# EAGLE design TheSmartTenDollarJob (EAGLE 6.4)
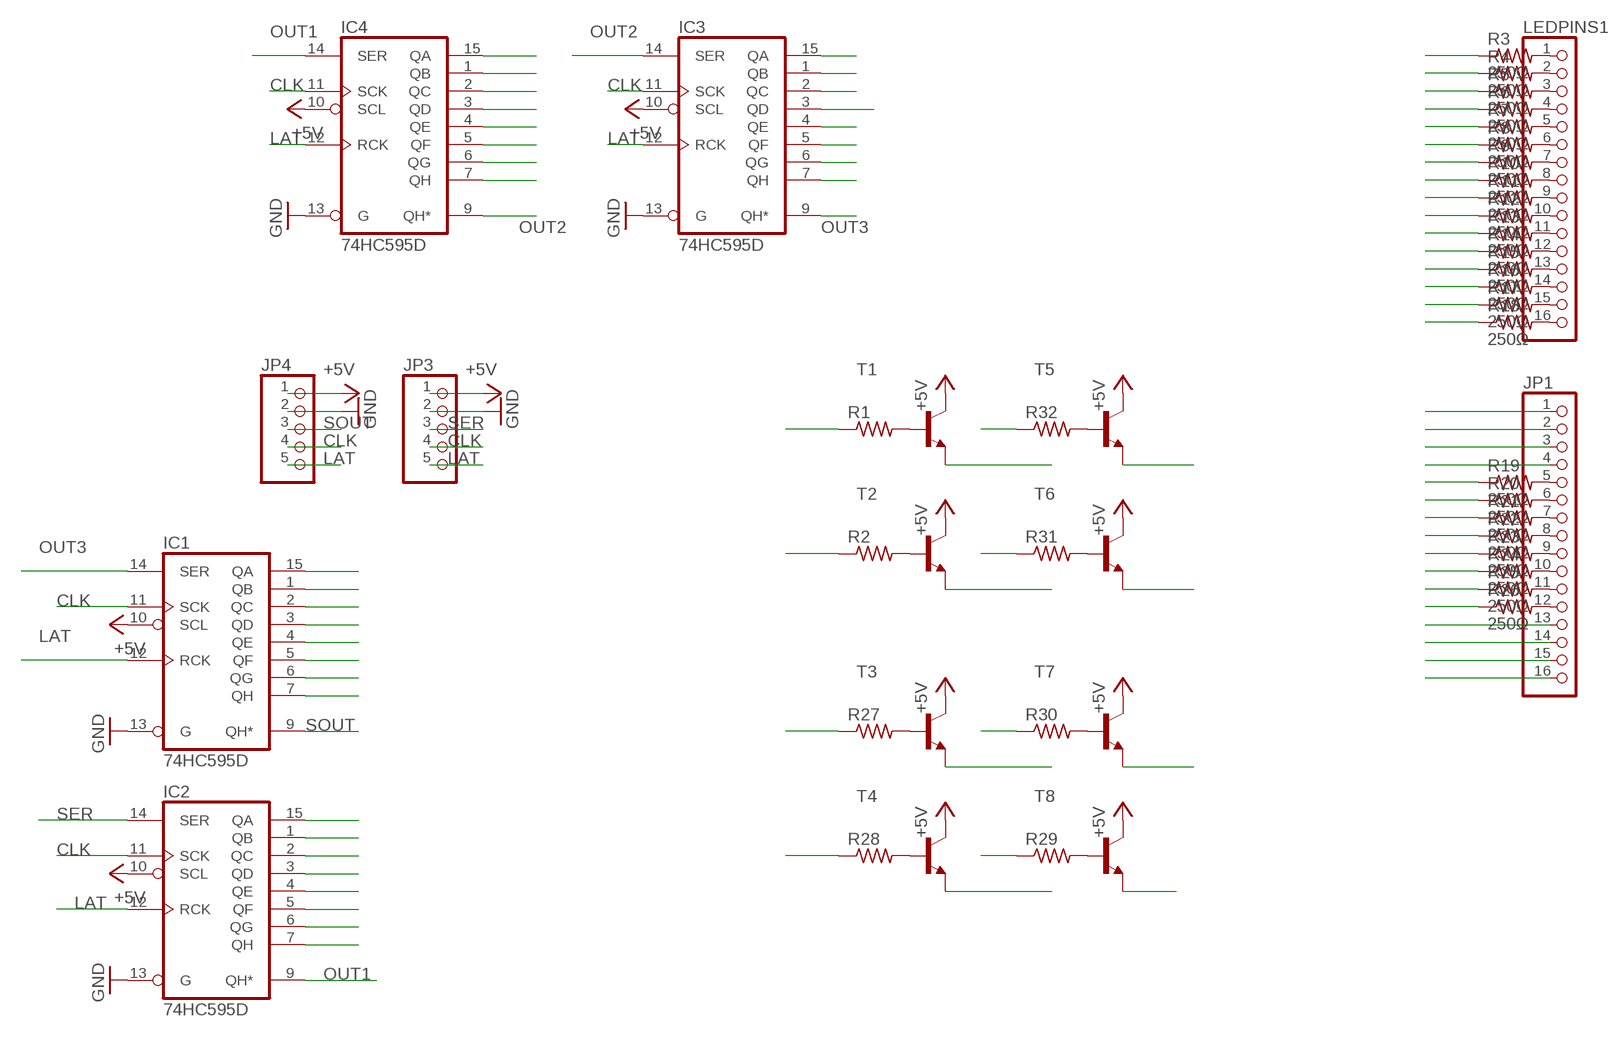
[diagram p0: schematic, sheet 1]

## Parts
IC1  74HC595D  [SO16]
IC2  74HC595D  [SO16]
IC3  74HC595D  [SO16]
IC4  74HC595D  [SO16]
JP1  PINHD-1X16  [1X16]
JP3  PINHD-1X5  [1X05]
JP4  PINHD-1X5  [1X05]
LEDPINS1  PINHD-1X16  [1X16]
R1  R-US_R0603  [R0603]
R2  R-US_R0603  [R0603]
R3  250Ω  R-US_R0603  [R0603]
R4  250Ω  R-US_R0603  [R0603]
R5  250Ω  R-US_R0603  [R0603]
R6  250Ω  R-US_R0603  [R0603]
R7  250Ω  R-US_R0603  [R0603]
R8  250Ω  R-US_R0603  [R0603]
R9  250Ω  R-US_R0603  [R0603]
R10  250Ω  R-US_R0603  [R0603]
R11  250Ω  R-US_R0603  [R0603]
R12  250Ω  R-US_R0603  [R0603]
R13  250Ω  R-US_R0603  [R0603]
R14  250Ω  R-US_R0603  [R0603]
R15  250Ω  R-US_R0603  [R0603]
R16  250Ω  R-US_R0603  [R0603]
R17  250Ω  R-US_R0603  [R0603]
R18  250Ω  R-US_R0603  [R0603]
R19  250Ω  R-US_R0603  [R0603]
R20  250Ω  R-US_R0603  [R0603]
R21  250Ω  R-US_R0603  [R0603]
R22  250Ω  R-US_R0603  [R0603]
R23  250Ω  R-US_R0603  [R0603]
R24  250Ω  R-US_R0603  [R0603]
R25  250Ω  R-US_R0603  [R0603]
R26  250Ω  R-US_R0603  [R0603]
R27  R-US_R0603  [R0603]
R28  R-US_R0603  [R0603]
R29  R-US_R0603  [R0603]
R30  R-US_R0603  [R0603]
R31  R-US_R0603  [R0603]
R32  R-US_R0603  [R0603]
T1  -NPN-SOT23-EBC  [SOT23-EBC]
T2  -NPN-SOT23-EBC  [SOT23-EBC]
T3  -NPN-SOT23-EBC  [SOT23-EBC]
T4  -NPN-SOT23-EBC  [SOT23-EBC]
T5  -NPN-SOT23-EBC  [SOT23-EBC]
T6  -NPN-SOT23-EBC  [SOT23-EBC]
T7  -NPN-SOT23-EBC  [SOT23-EBC]
T8  -NPN-SOT23-EBC  [SOT23-EBC]

## Nets
+5V: IC1.10(SCL) IC2.10(SCL) IC3.10(SCL) IC4.10(SCL) JP3.1 JP4.1 T1.C T2.C T3.C T4.C T5.C T6.C T7.C T8.C
CLK: IC1.11(SCK) IC2.11(SCK) IC3.11(SCK) IC4.11(SCK) JP3.4 JP4.4
GND: IC1.13(G) IC2.13(G) IC3.13(G) IC4.13(G) JP3.2 JP4.2
LAT: IC1.12(RCK) IC2.12(RCK) IC3.12(RCK) IC4.12(RCK) JP3.5 JP4.5
N$1: IC3.7(QH) R3.1
N$2: IC3.6(QG) R4.1
N$3: IC3.5(QF) R5.1
N$4: IC3.4(QE) R6.1
N$5: IC3.3(QD) R7.1
N$6: IC3.2(QC) R8.1
N$7: IC3.1(QB) R9.1
N$8: IC3.15(QA) R10.1
N$9: IC4.7(QH) R11.1
N$10: IC4.6(QG) R12.1
N$11: IC4.5(QF) R13.1
N$12: IC4.4(QE) R14.1
N$13: IC4.3(QD) R15.1
N$14: IC4.2(QC) R16.1
N$15: IC4.1(QB) R17.1
N$16: IC4.15(QA) R18.1
N$17: JP1.1 T1.E
N$18: JP1.2 T2.E
N$19: JP1.3 T3.E
N$20: JP1.4 T4.E
N$21: IC1.4(QE) R19.1
N$22: IC1.5(QF) R20.1
N$23: IC1.6(QG) R21.1
N$24: IC1.7(QH) R22.1
N$25: IC2.15(QA) R23.1
N$26: IC2.1(QB) R24.1
N$27: IC2.2(QC) R25.1
N$28: IC2.3(QD) R26.1
N$29: JP1.13 T5.E
N$30: JP1.14 T6.E
N$31: JP1.15 T7.E
N$32: JP1.16 T8.E
N$33: LEDPINS1.1 R3.2
N$34: R1.2 T1.B
N$35: LEDPINS1.2 R4.2
N$36: LEDPINS1.3 R5.2
N$37: LEDPINS1.4 R6.2
N$38: LEDPINS1.5 R7.2
N$39: LEDPINS1.6 R8.2
N$40: LEDPINS1.7 R9.2
N$41: LEDPINS1.8 R10.2
N$42: LEDPINS1.9 R11.2
N$43: LEDPINS1.10 R12.2
N$44: LEDPINS1.11 R13.2
N$45: LEDPINS1.12 R14.2
N$46: LEDPINS1.13 R15.2
N$47: LEDPINS1.14 R16.2
N$48: LEDPINS1.15 R17.2
N$49: LEDPINS1.16 R18.2
N$50: JP1.5 R19.2
N$51: JP1.6 R20.2
N$52: JP1.7 R21.2
N$53: JP1.8 R22.2
N$54: JP1.9 R23.2
N$55: JP1.10 R24.2
N$56: JP1.11 R25.2
N$57: JP1.12 R26.2
N$58: R2.2 T2.B
N$59: R27.2 T3.B
N$60: R28.2 T4.B
N$61: R29.2 T8.B
N$62: R30.2 T7.B
N$63: R31.2 T6.B
N$64: R32.2 T5.B
OUT1: IC2.9(QH*) IC4.14(SER)
OUT2: IC3.14(SER) IC4.9(QH*)
OUT3: IC1.14(SER) IC3.9(QH*)
QA: IC1.15(QA) R1.1
QB: IC1.1(QB) R2.1
QC: IC1.2(QC) R27.1
QD: IC1.3(QD) R28.1
QE: IC2.4(QE) R32.1
QF: IC2.5(QF) R31.1
QG: IC2.6(QG) R30.1
QH: IC2.7(QH) R29.1
SER: IC2.14(SER) JP3.3
SOUT: IC1.9(QH*) JP4.3

## Power pins joined to a net without a drawn wire
GND: IC1.8(GND) IC2.8(GND) IC3.8(GND) IC4.8(GND)
VCC: IC1.16(VCC) IC2.16(VCC) IC3.16(VCC) IC4.16(VCC)

## Library data of the parts
IC1-IC4 = 74xx-eu:74*595: 8-bit SHIFT REGISTER, output latch
JP1 LEDPINS1 = pinhead:PINHD-1X16: PIN HEADER
JP3 JP4 = pinhead:PINHD-1X5: PIN HEADER
R1 R2 R27-R32 = resistor:R-US_: RESISTOR, American symbol
R3-R26 = rcl:R-US_: RESISTOR, American symbol
T1-T8 = transistor:*-NPN-: NPN Transistror BF959 corrected 2008.03.06

## Board
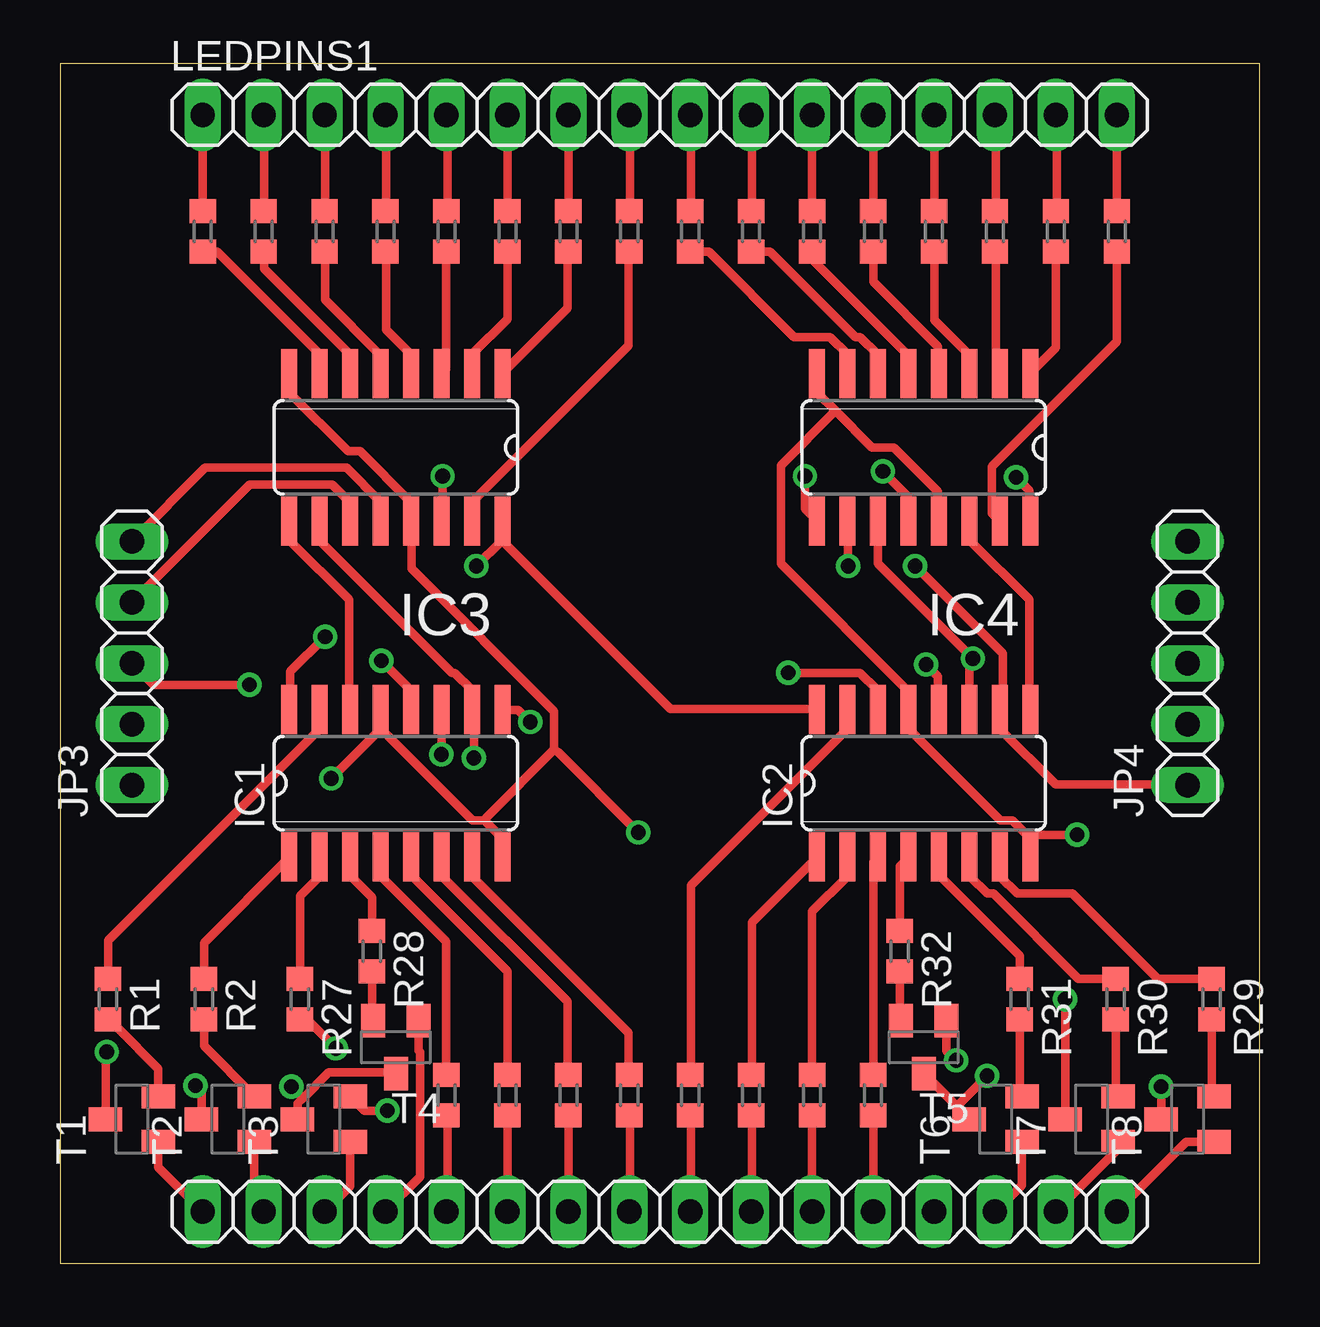
[diagram p1: board, top side]
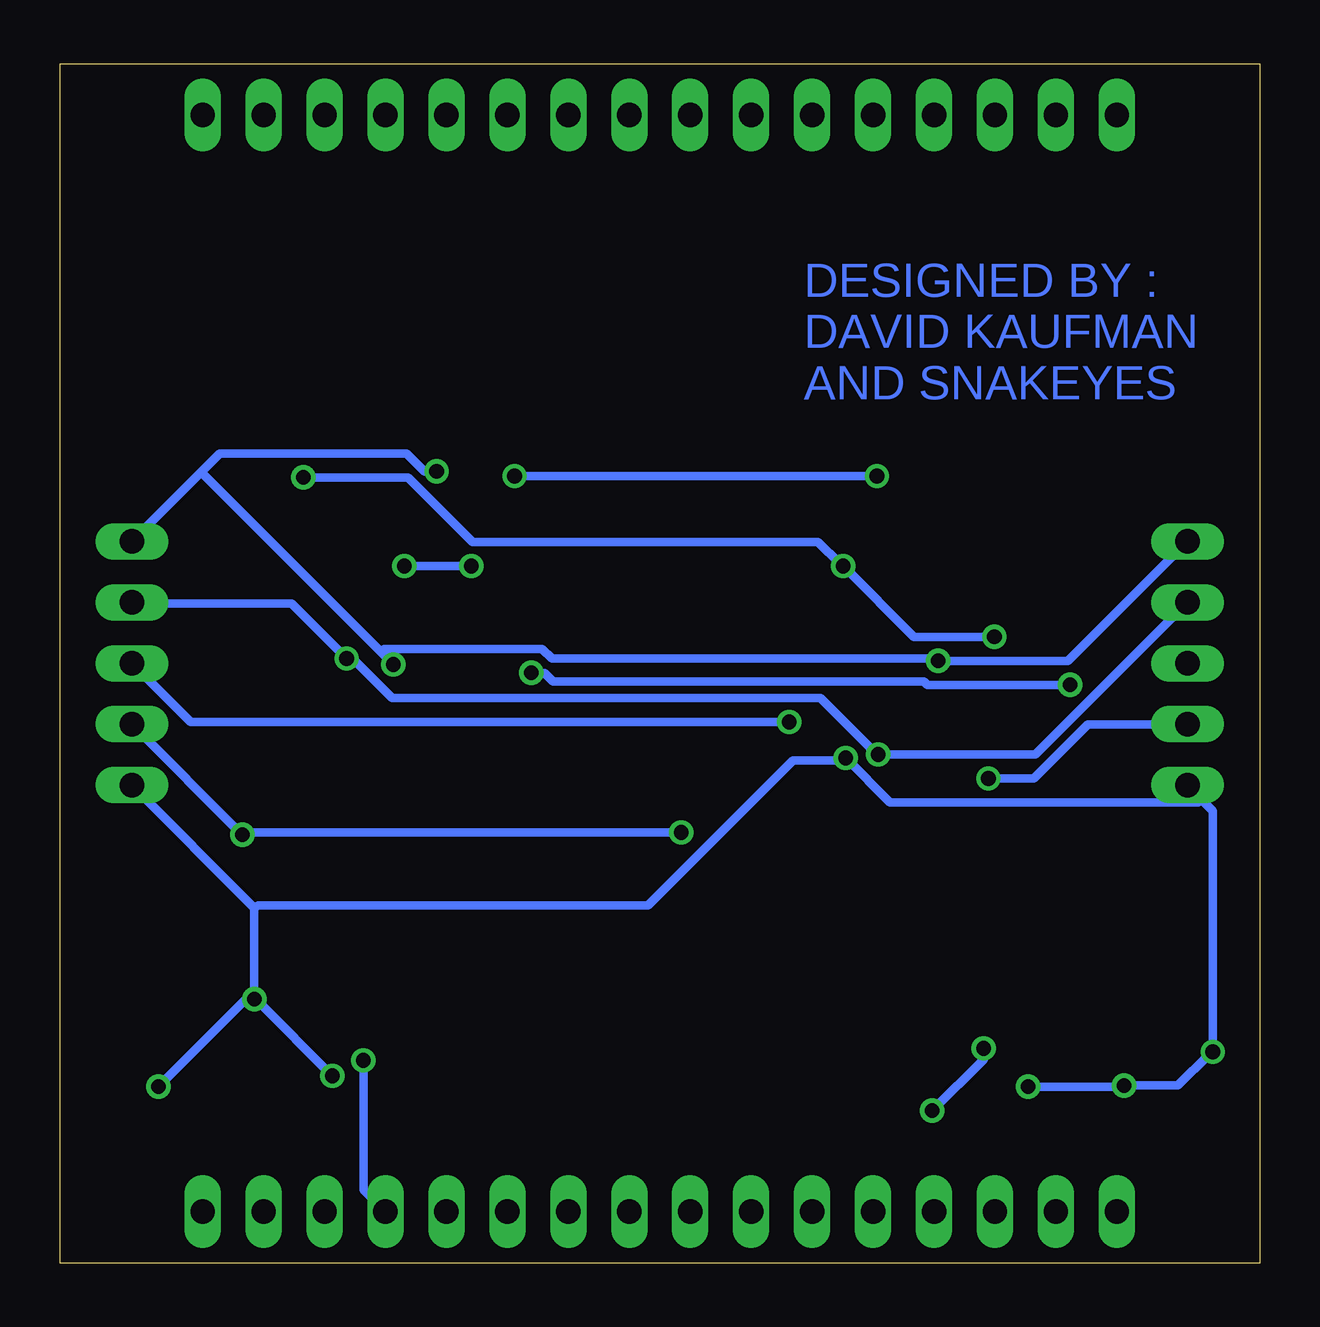
[diagram p2: board, bottom side, seen from below]

Size 50 x 50 mm. Coordinates in mm from the lower left corner, seen from the top.
Outline: 0,0 50,0 50,50 0,50 0,0
Copper layers (1*16): Top 0.035mm / dielectric 1.5mm / Bottom 0.035mm
Design rules "miters": minimum track width 14mil, minimum drill 24mil, track to track 12mil, track to pad 12mil, pad to pad 12mil, via to via 12mil, smd to smd 12mil, copper to edge 40mil, drill to drill 8mil, minimum pad ring 10mil, minimum via ring 8mil, stop-mask expansion 4mil, vias tented up to drill 0mil, thermal gap 10mil

### Footprints (pad centres in the part's own frame; a part is rotated, then mirrored left to right if it is on the bottom)
SO16 = smd 0.66 x 2.032: 1 -4.445,-3.073; 2 -3.175,-3.073; 3 -1.905,-3.073; 4 -0.635,-3.073; 5 0.635,-3.073; 6 1.905,-3.073; 7 3.175,-3.073; 8 4.445,-3.073; 9 4.445,3.073; 10 3.175,3.073; 11 1.905,3.073; 12 0.635,3.073; 13 -0.635,3.073; 14 -1.905,3.073; 15 -3.175,3.073; 16 -4.445,3.073
1X16 = drill 1.016 long: 1 -19.05,0; 2 -16.51,0; 3 -13.97,0; 4 -11.43,0; 5 -8.89,0; 6 -6.35,0; 7 -3.81,0; 8 -1.27,0; 9 1.27,0; 10 3.81,0; 11 6.35,0; 12 8.89,0; 13 11.43,0; 14 13.97,0; 15 16.51,0; 16 19.05,0
1X05 = drill 1.016 long: 1 -5.08,0; 2 -2.54,0; 3 0,0; 4 2.54,0; 5 5.08,0
R0603 = smd 1 x 1.1: 1 -0.85,0; 2 0.85,0
SOT23-EBC = smd 1 x 1.4: B 0.95,-1.1; C 0,1.1; E -0.95,-1.1

### Placement (x,y rotation side)
IC1  14,20 0 top
IC2  36,20 0 top
IC3  14,34 180 top
IC4  36,34 180 top
JP1  25,2.14 0 top
JP3  3,25 90 top
JP4  47,25 90 top
LEDPINS1  25,47.86 0 top
R1  2,11 270 top
R2  6,11 270 top
R3  5.95,43 90 top
R4  8.49,43 90 top
R5  11.03,43 90 top
R6  13.57,43 90 top
R7  16.11,43 90 top
R8  18.65,43 90 top
R9  21.19,43 90 top
R10  23.73,43 90 top
R11  26.27,43 90 top
R12  28.81,43 90 top
R13  31.35,43 90 top
R14  33.89,43 90 top
R15  36.43,43 90 top
R16  38.97,43 90 top
R17  41.51,43 90 top
R18  44.05,43 90 top
R19  16.11,7 270 top
R20  18.65,7 270 top
R21  21.19,7 270 top
R22  23.73,7 270 top
R23  26.27,7 270 top
R24  28.81,7 270 top
R25  31.35,7 270 top
R26  33.89,7 270 top
R27  10,11 270 top
R28  13,13 270 top
R29  48,11 270 top
R30  44,11 270 top
R31  40,11 270 top
R32  35,13 270 top
T1  3,6 90 top
T2  7,6 90 top
T3  11,6 90 top
T4  14,9 180 top
T5  36,9 180 top
T6  39,6 90 top
T7  43,6 90 top
T8  47,6 90 top

### Tracks (layer width: path | path; a pad name or v marks a point on that pad's centre or on a via)
+5V  (via drill 0.61)
  Top 0.356: IC3.10 10.85,30.9 10.85,30.1 16.35,24.6 16.45,24.6 17.15,23.9 17.15,23.1 IC1.10 17.25,22.9 v17.25,21.05 | T3.C 9.9,6.65 10.12,6.88 | 10.12,6.88 11.2,7.95 13.95,7.95 T4.C | T1.C 1.9,8.75 v1.95,8.8 | T2.C 5.9,7.15 v5.65,7.4 | v9.65,7.35 10.12,6.88 | T5.C 37.38,6.53 | 37.38,6.53 T6.C | v41.9,11 T7.C | v45.9,7.35 T8.C | JP4.1 47,19.95 41.5,19.95 39.2,22.25 39.2,23.05 IC2.10 39.3,23.2 39.3,25.4 v35.65,29.05 | v32.85,29.05 32.85,30.9 IC4.10 | v38.65,7.8 37.38,6.53
  Bottom 0.356: v9.65,7.35 5.8,7.35 v5.65,7.4 3.4,7.4 2.1,8.7 v1.95,8.8 1.95,18.85 3,19.9 JP3.1 2.55,19.2 15.4,19.2 v17.25,21.05 17.4,20.95 19.45,20.95 25.5,14.9 41.75,14.9 41.9,14.8 | 41.9,14.8 v41.9,11 | 41.9,14.8 47,19.9 JP4.1 | v45.9,7.35 42.05,11.2 v41.9,11 | v35.65,29.05 v32.85,29.05 | v38.65,7.8 41.75,10.9 v41.9,11
CLK  (via drill 0.61)
  Top 0.356: 37.9,25.2 37.9,25.35 34.1,29.15 34.1,30.9 IC4.11 | 37.9,25.2 37.9,23.1 IC2.11 | v38.05,25.2 37.9,25.2 | v15.9,21.2 15.9,23.05 IC1.11 | IC3.11 12.05,30.95 12.05,31.75 11.35,32.45 7.9,32.45 JP3.4
  Bottom 0.356: JP4.4 47,27.5 40.35,27.5 v38.05,25.2 37.9,25.1 37.7,25.1 36.15,23.55 18.3,23.55 16.05,21.3 v15.9,21.2 9.35,21.2 JP3.4
GND  (via drill 0.61)
  Top 0.356: 32.33,35.52 33.85,34 34.75,34 36.6,32.15 36.6,30.95 IC4.13 | 32.33,35.52 31.6,36.25 31.6,37.05 IC4.8 | v42.4,17.85 40.55,17.85 IC2.8 40.4,16.95 40.4,17.75 39.7,18.45 39.2,18.45 35.4,22.25 35.4,23.05 IC2.13 35.35,23.25 35.35,23.85 30.05,29.15 30.05,33.25 32.33,35.52 | IC3.8 9.6,37.05 9.6,36.25 12,33.85 12.5,33.85 14.6,31.75 14.6,30.95 IC3.13 14.65,30.75 14.65,28.95 20.6,23 20.6,21.4 | 17.7,18.45 17.2,18.45 13.4,22.25 13.4,23.05 IC1.13 13.25,22.15 v11.3,20.2 | 17.7,18.45 18.4,17.75 18.4,16.95 IC1.8 | 20.6,21.4 17.8,18.6 17.7,18.45 | v24.1,17.95 20.75,21.3 20.6,21.4
  Bottom 0.356: JP4.2 v42.4,17.85 42.25,17.95 v24.1,17.95 | v11.3,20.2 9.4,20.2 7.15,22.45 JP3.2
LAT  (via drill 0.61)
  Top 0.356: IC3.12 13.35,30.95 13.35,31.75 11.95,33.15 6.05,33.15 3,30.1 JP3.5 | v13.4,25.1 14.6,23.9 14.6,23.1 IC1.12 | v34.3,33 35.35,31.95 35.35,30.95 IC4.12 | v36.1,24.95 36.6,24.45 36.6,23.1 IC2.12
  Bottom 0.356: JP3.5 3,30.1 8,25.1 v13.4,25.1 13.55,25.2 29.5,25.2 29.9,25.6 36.5,25.6 36.62,25.48 | v34.3,33 34.8,33 35.55,33.75 43.35,33.75 44.12,32.98 | 44.12,32.98 47,30.1 JP4.5 | 44.12,32.98 36.62,25.48 | 36.62,25.48 v36.1,24.95
N$1
  Top 0.356: R3.1 6.55,42.15 10.8,37.9 10.8,37.1 IC3.7
N$2
  Top 0.356: R4.1 8.5,41.45 12.05,37.9 12.05,37.1 IC3.6
N$3
  Top 0.356: R5.1 11.05,42.15 11.05,40.15 13.35,37.85 13.35,37.1 IC3.5
N$4
  Top 0.356: R6.1 13.6,42.15 13.6,38.9 14.6,37.9 14.6,37.1 IC3.4
N$5
  Top 0.356: R7.1 16.1,37.25 15.95,37.1 IC3.3
N$6
  Top 0.356: R8.1 18.65,39.35 17.2,37.9 17.2,37.1 IC3.2
N$7
  Top 0.356: R9.1 21.15,42.15 21.15,39.8 18.45,37.1 IC3.1
N$8
  Top 0.356: R10.1 23.7,42.15 23.7,38.25 17.2,31.75 17.2,30.95 IC3.15
N$9
  Top 0.356: R11.1 27.05,42.15 30.6,38.6 32.1,38.6 32.8,37.9 32.8,37.1 IC4.7
N$10
  Top 0.356: R12.1 29.6,42.15 33.15,38.6 33.35,38.6 34.05,37.9 34.05,37.1 IC4.6
N$11
  Top 0.356: R13.1 31.35,41.85 35.35,37.85 35.35,37.1 IC4.5
N$12
  Top 0.356: R14.1 33.9,40.9 36.6,38.2 36.6,37.1 IC4.4
N$13
  Top 0.356: R15.1 36.45,42.15 36.45,39.3 37.9,37.85 37.9,37.1 IC4.3
N$14
  Top 0.356: R16.1 39,42.15 39,37.25 39.15,37.1 IC4.2
N$15
  Top 0.356: R17.1 41.5,38.15 40.45,37.1 IC4.1
N$16
  Top 0.356: R18.1 44.05,38.4 38.85,33.2 38.85,31.25 39.15,30.95 IC4.15
N$17
  Top 0.356: T1.E 4.1,4 JP1.1
N$18
  Top 0.356: T2.E 8.1,2.5 8.45,2.15 JP1.2
N$19
  Top 0.356: T3.E 12.1,3.2 11.05,2.15 JP1.3
N$20
  Top 0.356: T4.E 14.95,8.85 15,8.8 15,3.6 13.55,2.15 JP1.4
N$21
  Top 0.356: R19.1 16.1,13.4 13.4,16.1 13.4,16.9 IC1.4
N$22
  Top 0.356: R20.1 18.65,12.15 14.65,16.15 14.65,16.9 IC1.5
N$23
  Top 0.356: R21.1 21.15,7.85 21.15,10.9 15.95,16.1 15.95,16.9 IC1.6
N$24
  Top 0.356: R22.1 23.7,7.85 23.7,9.6 17.2,16.1 17.2,16.9 IC1.7
N$25
  Top 0.356: R23.1 26.3,7.85 26.3,15.75 32.8,22.25 32.8,23.05 IC2.15
N$26
  Top 0.356: R24.1 28.85,7.85 28.85,14.2 31.55,16.9 IC2.1
N$27
  Top 0.356: R25.1 31.35,14.65 32.8,16.1 32.8,16.9 IC2.2
N$28
  Top 0.356: R26.1 33.9,16.75 34.05,16.9 IC2.3
N$29  (via drill 0.61)
  Top 0.356: T5.E 36.95,8.85 v37.35,8.45
  Bottom 0.356: v37.35,8.45 37.35,3.05 36.45,2.15 JP1.13
N$30
  Top 0.356: T6.E 40.1,3.25 39,2.15 JP1.14
N$31
  Top 0.356: T7.E 44.1,4.75 JP1.15
N$32
  Top 0.356: T8.E 46.95,5.05 JP1.16
N$33
  Top 0.356: LEDPINS1.1 R3.2
N$34
  Top 0.356: R1.2 2.35,9.8 2.4,9.8 4.1,8.1 T1.B
N$35
  Top 0.356: R4.2 LEDPINS1.2
N$36
  Top 0.356: R5.2 11.05,43.85 11.05,47.85 LEDPINS1.3
N$37
  Top 0.356: R6.2 13.6,43.85 13.6,47.85 LEDPINS1.4
N$38
  Top 0.356: R7.2 16.15,43.85 16.15,47.85 LEDPINS1.5
N$39
  Top 0.356: LEDPINS1.6 R8.2
N$40
  Top 0.356: R9.2 LEDPINS1.7
N$41
  Top 0.356: R10.2 23.75,43.85 23.75,47.85 LEDPINS1.8
N$42
  Top 0.356: R11.2 26.3,43.85 26.3,47.85 LEDPINS1.9
N$43
  Top 0.356: R12.2 28.85,43.85 28.85,47.85 LEDPINS1.10
N$44
  Top 0.356: LEDPINS1.11 R13.2
N$45
  Top 0.356: R14.2 LEDPINS1.12
N$46
  Top 0.356: R15.2 36.45,43.85 36.45,47.85 LEDPINS1.13
N$47
  Top 0.356: R16.2 39,43.85 39,47.85 LEDPINS1.14
N$48
  Top 0.356: R17.2 41.55,43.85 41.55,47.85 LEDPINS1.15
N$49
  Top 0.356: LEDPINS1.16 R18.2
N$50
  Top 0.356: R19.2 16.15,6.15 16.15,2.15 JP1.5
N$51
  Top 0.356: JP1.6 R20.2
N$52
  Top 0.356: R21.2 JP1.7
N$53
  Top 0.356: R22.2 23.75,6.15 23.75,2.15 JP1.8
N$54
  Top 0.356: R23.2 26.3,6.15 26.3,2.15 JP1.9
N$55
  Top 0.356: R24.2 28.85,6.15 28.85,2.15 JP1.10
N$56
  Top 0.356: JP1.11 R25.2
N$57
  Top 0.356: R26.2 JP1.12
N$58
  Top 0.356: R2.2 6,9.05 T2.B
N$59  (via drill 0.61)
  Top 0.356: R27.2 10.3,10.15 v11.5,8.95 | v13.65,6.35 12.7,6.35 T3.B
  Bottom 0.356: v11.5,8.95 11.5,8.5 v13.65,6.35
N$60
  Top 0.356: R28.2 13,10.15 T4.B
N$61
  Top 0.356: R29.2 48,7.05 T8.B
N$62
  Top 0.356: R30.2 44,7.05 T7.B
N$63
  Top 0.356: R31.2 40,7.05 T6.B
N$64
  Top 0.356: R32.2 35,10.15 T5.B
OUT1
  Top 0.356: IC2.9 40.4,23.1 40.4,27.65 37.95,30.1 37.95,30.9 IC4.14
OUT2  (via drill 0.61)
  Top 0.356: v15.95,32.8 15.95,30.95 IC3.14 | v31.05,32.8 31.05,31.45 31.55,30.95 IC4.9
  Bottom 0.356: v31.05,32.8 v15.95,32.8
OUT3
  Top 0.356: IC1.14 12.05,23.1 12.05,27.65 9.6,30.1 9.6,30.9 IC3.9
QA
  Top 0.356: R1.1 2,13.45 10.8,22.25 10.8,23.05 IC1.15
QB
  Top 0.356: R2.1 6,13.35 9.55,16.9 IC1.1
QC
  Top 0.356: R27.1 10,15.3 10.8,16.1 10.8,16.9 IC1.2
QD
  Top 0.356: R28.1 13,15.25 12.1,16.15 12.1,16.9 IC1.3
QE
  Top 0.356: R32.1 35,16.55 35.35,16.9 IC2.4
QF
  Top 0.356: R31.1 40,12.8 36.65,16.15 36.65,16.9 IC2.5
QG
  Top 0.356: R30.1 42.45,11.85 38.9,15.4 38.65,15.4 37.95,16.1 37.95,16.9 IC2.6
QH
  Top 0.356: R29.1 45.75,11.85 42.2,15.4 39.9,15.4 39.2,16.1 39.2,16.9 IC2.7
SER  (via drill 0.61)
  Top 0.356: v30.35,24.6 33.35,24.6 34.05,23.9 34.05,23.1 IC2.14 | v7.9,24.1 3.9,24.1 JP3.3
  Bottom 0.356: v30.35,24.6 29.8,24.6 29.45,24.25 14,24.25 13.85,24.1 v7.9,24.1
SOUT  (via drill 0.61)
  Top 0.356: v19.6,22.55 19.1,23.05 18.45,23.05 IC1.9
  Bottom 0.356: v19.6,22.55 44.55,22.55 JP4.3
VCC  (via drill 0.61)
  Top 0.356: v11.05,26.1 9.6,24.65 9.6,23.1 IC1.16 | v17.35,29.05 18.4,30.1 18.4,30.9 IC3.16 18.55,30 25.45,23.1 31.55,23.1 IC2.16 | v39.85,32.75 40.4,32.2 40.4,30.95 IC4.16
  Bottom 0.356: v11.05,26.1 14.4,26.1 v17.35,29.05 17.5,29.15 18.4,30.05 32.8,30.05 35.5,32.75 v39.85,32.75

### Text on the board
Bottom: DESIGNED BY : / DAVID KAUFMAN / AND SNAKEYES